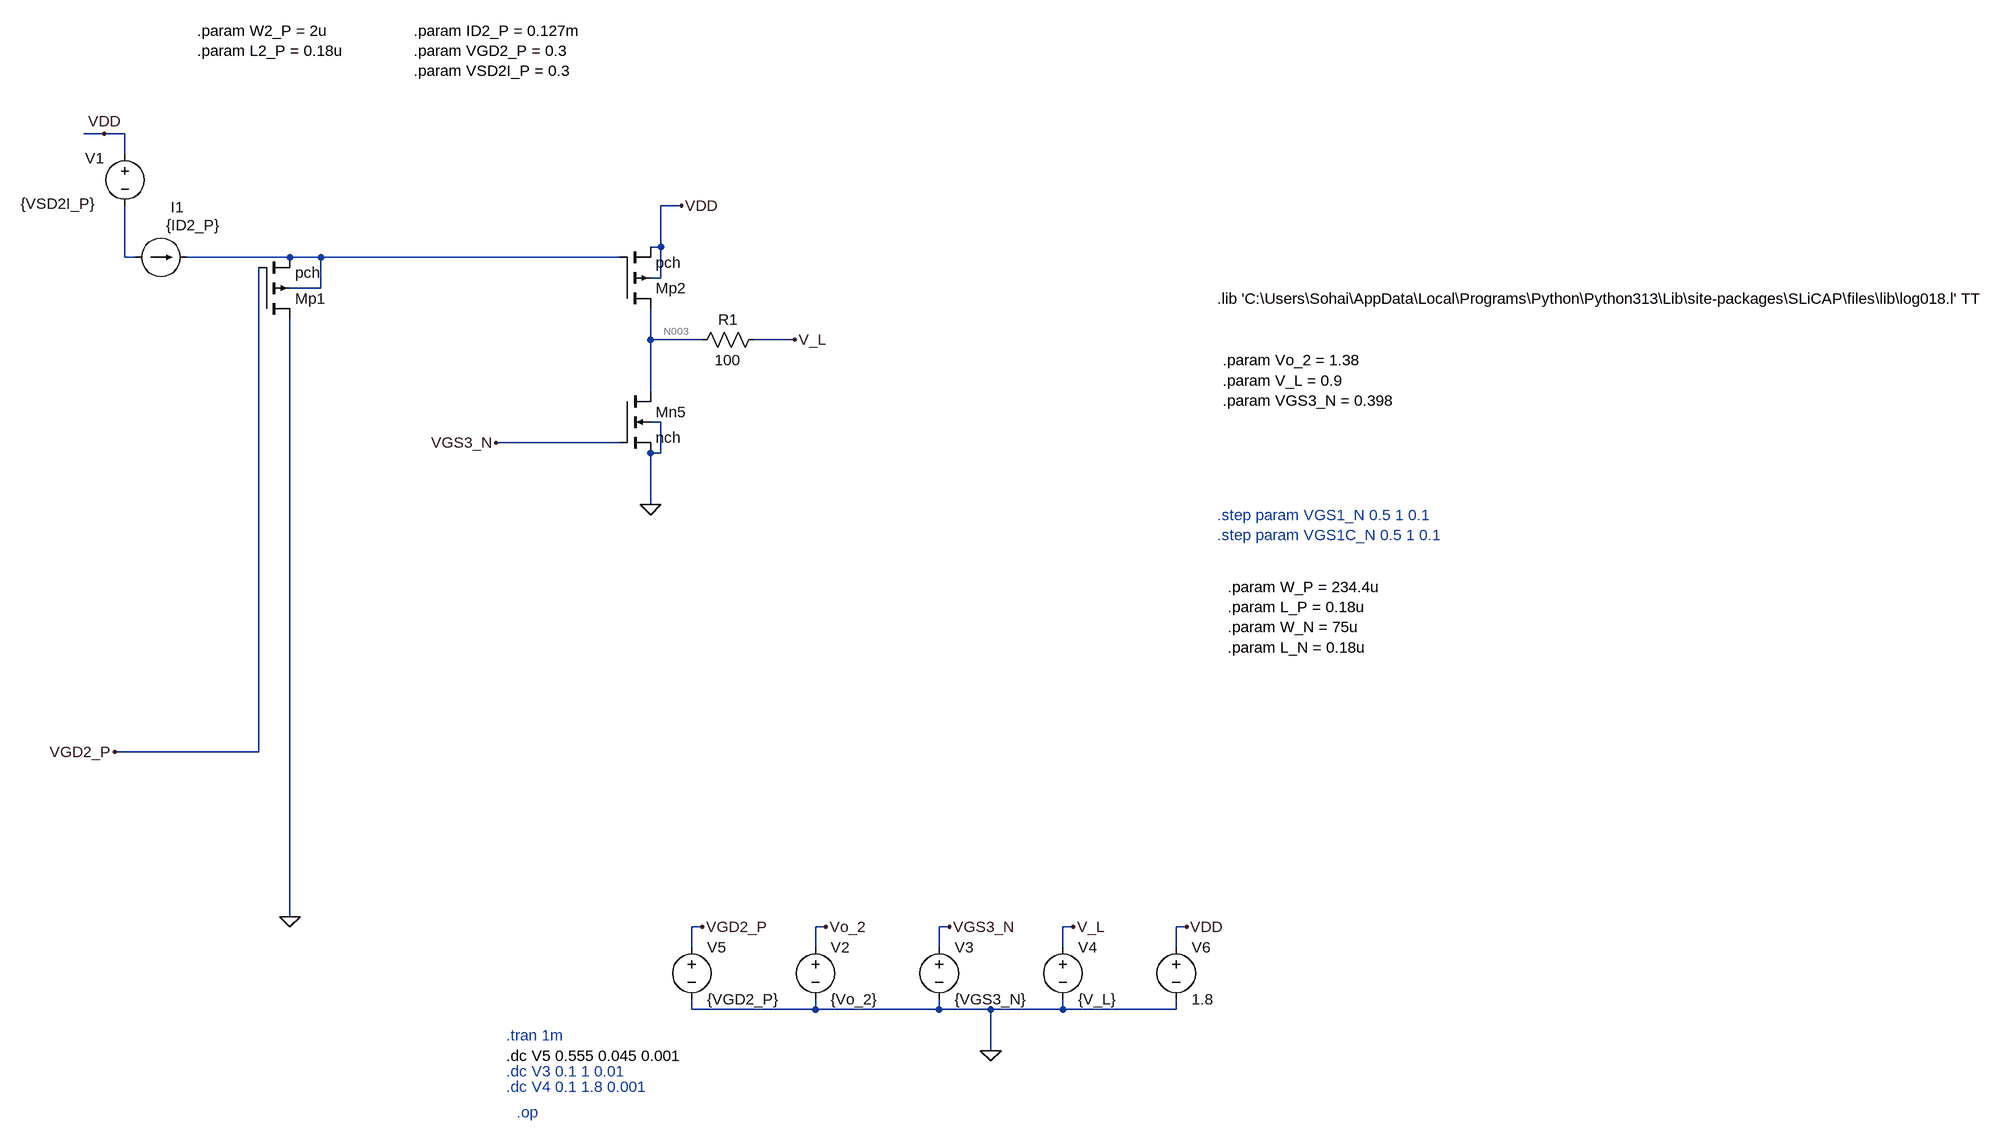
[diagram p0: schematic 3_.asc]
3_.asc, the LTspice schematic file:
Version 4
SHEET 1 2348 736
WIRE -736 -832 -768 -832
WIRE -704 -832 -736 -832
WIRE -704 -800 -704 -832
WIRE 160 -720 128 -720
WIRE 128 -656 128 -720
WIRE 128 -656 112 -656
WIRE -704 -640 -704 -720
WIRE -688 -640 -704 -640
WIRE -448 -640 -608 -640
WIRE -400 -640 -448 -640
WIRE 64 -640 -400 -640
WIRE 128 -608 128 -656
WIRE 128 -608 112 -608
WIRE -400 -592 -400 -640
WIRE -400 -592 -448 -592
WIRE 112 -512 112 -560
WIRE 192 -512 112 -512
WIRE 336 -512 272 -512
WIRE 112 -432 112 -512
WIRE 128 -384 112 -384
WIRE 64 -352 -128 -352
WIRE 128 -336 128 -384
WIRE 128 -336 112 -336
WIRE 112 -256 112 -336
WIRE -496 128 -496 -624
WIRE -496 128 -720 128
WIRE -448 384 -448 -544
WIRE 192 400 176 400
WIRE 384 400 368 400
WIRE 576 400 560 400
WIRE 768 400 752 400
WIRE 944 400 928 400
WIRE 176 432 176 400
WIRE 368 432 368 400
WIRE 560 432 560 400
WIRE 752 432 752 400
WIRE 928 432 928 400
WIRE 176 528 176 512
WIRE 368 528 368 512
WIRE 368 528 176 528
WIRE 560 528 560 512
WIRE 560 528 368 528
WIRE 640 528 560 528
WIRE 752 528 752 512
WIRE 752 528 640 528
WIRE 928 528 928 512
WIRE 928 528 752 528
WIRE 640 592 640 528
FLAG 640 592 0
FLAG 384 400 Vo_2
FLAG 576 400 VGS3_N
FLAG 768 400 V_L
FLAG 944 400 VDD
FLAG 336 -512 V_L
FLAG 160 -720 VDD
FLAG 112 -256 0
FLAG -128 -352 VGS3_N
FLAG -736 -832 VDD
FLAG -448 384 0
FLAG -720 128 VGD2_P
FLAG 192 400 VGD2_P
DATAFLAG -592 128 ""
DATAFLAG -288 -640 ""
DATAFLAG 112 -544 ""
SYMBOL voltage 368 416 R0
WINDOW 123 0 0 Left 0
WINDOW 39 0 0 Left 0
SYMATTR InstName V2
SYMATTR Value {Vo_2}
SYMBOL voltage 560 416 R0
WINDOW 123 0 0 Left 0
WINDOW 39 0 0 Left 0
SYMATTR InstName V3
SYMATTR Value {VGS3_N}
SYMBOL voltage 752 416 R0
WINDOW 123 0 0 Left 0
WINDOW 39 0 0 Left 0
SYMATTR InstName V4
SYMATTR Value {V_L}
SYMBOL voltage 928 416 R0
WINDOW 123 0 0 Left 0
WINDOW 39 0 0 Left 0
SYMATTR InstName V6
SYMATTR Value 1.8
SYMBOL pmos4 64 -560 M180
SYMATTR InstName Mp2
SYMATTR Value pch
SYMATTR Value2 l={L_P} w={W_P/4} m=4
SYMBOL nmos4 64 -432 R0
SYMATTR InstName Mn5
SYMATTR Value nch
SYMATTR Value2 l={L_N} w={W_N/4} m=4
SYMBOL res 288 -528 R90
WINDOW 0 0 56 VBottom 2
WINDOW 3 32 56 VTop 2
SYMATTR InstName R1
SYMATTR Value 100
SYMBOL pmos4 -496 -544 M180
SYMATTR InstName Mp1
SYMATTR Value pch
SYMATTR Value2 l={L2_P} w={W2_P}
SYMBOL current -688 -640 R270
WINDOW 123 0 0 Left 0
WINDOW 39 0 0 Left 0
WINDOW 0 78 55 VRight 2
WINDOW 3 50 48 VRight 2
SYMATTR InstName I1
SYMATTR Value {ID2_P}
SYMBOL voltage -704 -816 R0
WINDOW 123 0 0 Left 0
WINDOW 39 0 0 Left 0
WINDOW 0 -62 22 Left 2
WINDOW 3 -162 93 Left 2
SYMATTR InstName V1
SYMATTR Value {VSD2I_P}
SYMBOL voltage 176 416 R0
WINDOW 123 0 0 Left 0
WINDOW 39 0 0 Left 0
SYMATTR InstName V5
SYMATTR Value {VGD2_P}
TEXT 1000 -480 Left 2 !.param Vo_2 = 1.38\n.param V_L = 0.9\n.param VGS3_N = 0.398
TEXT -112 568 Left 2 ;.tran 1m
TEXT -112 600 Left 2 !.dc V5 0.555 0.045 0.001
TEXT 992 -240 Left 2 ;.step param VGS1_N 0.5 1 0.1\n.step param VGS1C_N 0.5 1 0.1
TEXT -112 648 Left 2 ;.dc V4 0.1 1.8 0.001
TEXT -96 688 Left 2 ;.op
TEXT -112 624 Left 2 ;.dc V3 0.1 1 0.01
TEXT 1008 -128 Left 2 !.param W_P = 234.4u\n.param L_P = 0.18u\n.param W_N = 75u\n.param L_N = 0.18u
TEXT 992 -576 Left 2 !.lib 'C:\\Users\\Sohai\\AppData\\Local\\Programs\\Python\\Python313\\Lib\\site-packages\\SLiCAP\\files\\lib\\log018.l' TT
TEXT -592 -992 Left 2 !.param W2_P = 2u\n.param L2_P = 0.18u
TEXT -256 -992 Left 2 !.param ID2_P = 0.127m\n.param VGD2_P = 0.3\n.param VSD2I_P = 0.3

The netlist it stands for:
* 3_.asc
V2 Vo_2 0 {Vo_2}
V3 VGS3_N 0 {VGS3_N}
V4 V_L 0 {V_L}
V6 VDD 0 1.8
Mp2 N003 N002 VDD VDD pch l={L_P} w={W_P/4} m=4
Mn5 N003 VGS3_N 0 0 nch l={L_N} w={W_N/4} m=4
R1 V_L N003 100
Mp1 0 VGD2_P N002 N002 pch l={L2_P} w={W2_P}
I1 N001 N002 {ID2_P}
V1 VDD N001 {VSD2I_P}
V5 VGD2_P 0 {VGD2_P}
.model NMOS NMOS
.model PMOS PMOS
.lib standard.mos
.param Vo_2 = 1.38
.param V_L = 0.9
.param VGS3_N = 0.398
* .tran 1m
.dc V5 0.555 0.045 0.001
* .step param VGS1_N 0.5 1 0.1
* .step param VGS1C_N 0.5 1 0.1
* .dc V4 0.1 1.8 0.001
* .op
* .dc V3 0.1 1 0.01
.param W_P = 234.4u
.param L_P = 0.18u
.param W_N = 75u
.param L_N = 0.18u
.lib 'C:\Users\Sohai\AppData\Local\Programs\Python\Python313\Lib\site-packages\SLiCAP\files\lib\log018.l' TT
.param W2_P = 2u
.param L2_P = 0.18u
.param ID2_P = 0.127m
.param VGD2_P = 0.3
.param VSD2I_P = 0.3
.backanno
.end

* Results of the author's LTspice run, read from the files saved beside the schematic
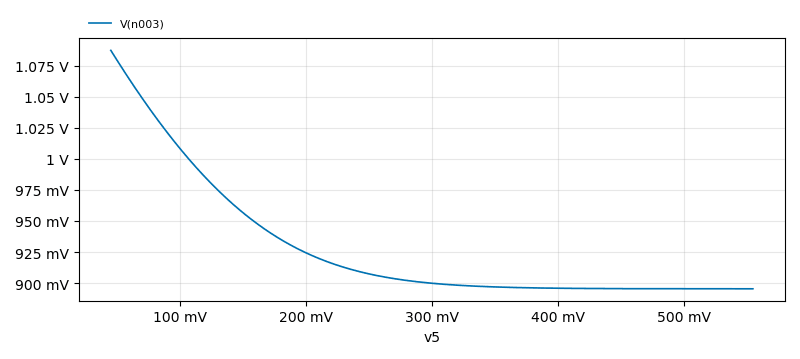
[diagram p1: DC transfer characteristic of 3_.asc, plotted from the saved traces]
* DC transfer characteristic, 1 run:
*   V(n003): 895.4 mV at v5=555 mV, 1.087 V at v5=45 mV, min 895.4 mV, max 1.087 V